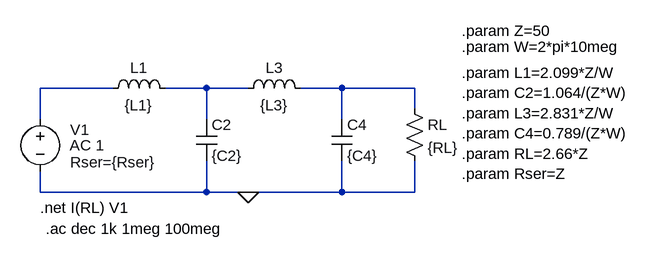
[diagram p0: schematic TS15.asc]
TS15.asc, the LTspice schematic file:
Version 4
SHEET 1 1664 680
WIRE 32 128 -80 128
WIRE 176 128 112 128
WIRE 240 128 176 128
WIRE 384 128 320 128
WIRE 496 128 384 128
WIRE 496 160 496 128
WIRE -80 176 -80 128
WIRE 176 176 176 128
WIRE 384 176 384 128
WIRE -80 288 -80 256
WIRE 176 288 176 240
WIRE 176 288 -80 288
WIRE 240 288 176 288
WIRE 384 288 384 240
WIRE 384 288 240 288
WIRE 496 288 496 240
WIRE 496 288 384 288
FLAG 240 288 0
SYMBOL ind 16 144 R270
WINDOW 0 32 56 VTop 2
WINDOW 3 5 56 VBottom 2
SYMATTR InstName L1
SYMATTR Value {L1}
SYMBOL cap 160 176 R0
SYMATTR InstName C2
SYMATTR Value {C2}
SYMBOL ind 224 144 R270
WINDOW 0 32 56 VTop 2
WINDOW 3 5 56 VBottom 2
SYMATTR InstName L3
SYMATTR Value {L3}
SYMBOL cap 368 176 R0
SYMATTR InstName C4
SYMATTR Value {C4}
SYMBOL res 480 144 R0
SYMATTR InstName RL
SYMATTR Value {RL}
SYMBOL voltage -80 160 R0
WINDOW 0 46 32 Left 2
WINDOW 123 45 56 Left 2
WINDOW 39 46 82 Left 2
SYMATTR InstName V1
SYMATTR Value ""
SYMATTR Value2 AC 1
SYMATTR SpiceLine Rser={Rser}
TEXT -72 344 Left 2 !.ac dec 1k 1meg 100meg
TEXT -80 312 Left 2 !.net I(RL) V1
TEXT 568 64 Left 2 !.param W=2*pi*10meg
TEXT 568 104 Left 2 !.param L1=2.099*Z/W \n.param C2=1.064/(Z*W) \n.param L3=2.831*Z/W \n.param C4=0.789/(Z*W) \n.param RL=2.66*Z \n.param Rser=Z
TEXT 568 40 Left 2 !.param Z=50

The netlist it stands for:
* TS15.asc
L1 N001 N002 {L1}
C2 N002 0 {C2}
L3 N002 N003 {L3}
C4 N003 0 {C4}
RL N003 0 {RL}
V1 N001 0 AC 1 Rser={Rser}
.ac dec 1k 1meg 100meg
.net I(RL) V1
.param W=2*pi*10meg
.param L1=2.099*Z/W
.param C2=1.064/(Z*W)
.param L3=2.831*Z/W
.param C4=0.789/(Z*W)
.param RL=2.66*Z
.param Rser=Z
.param Z=50
.backanno
.end